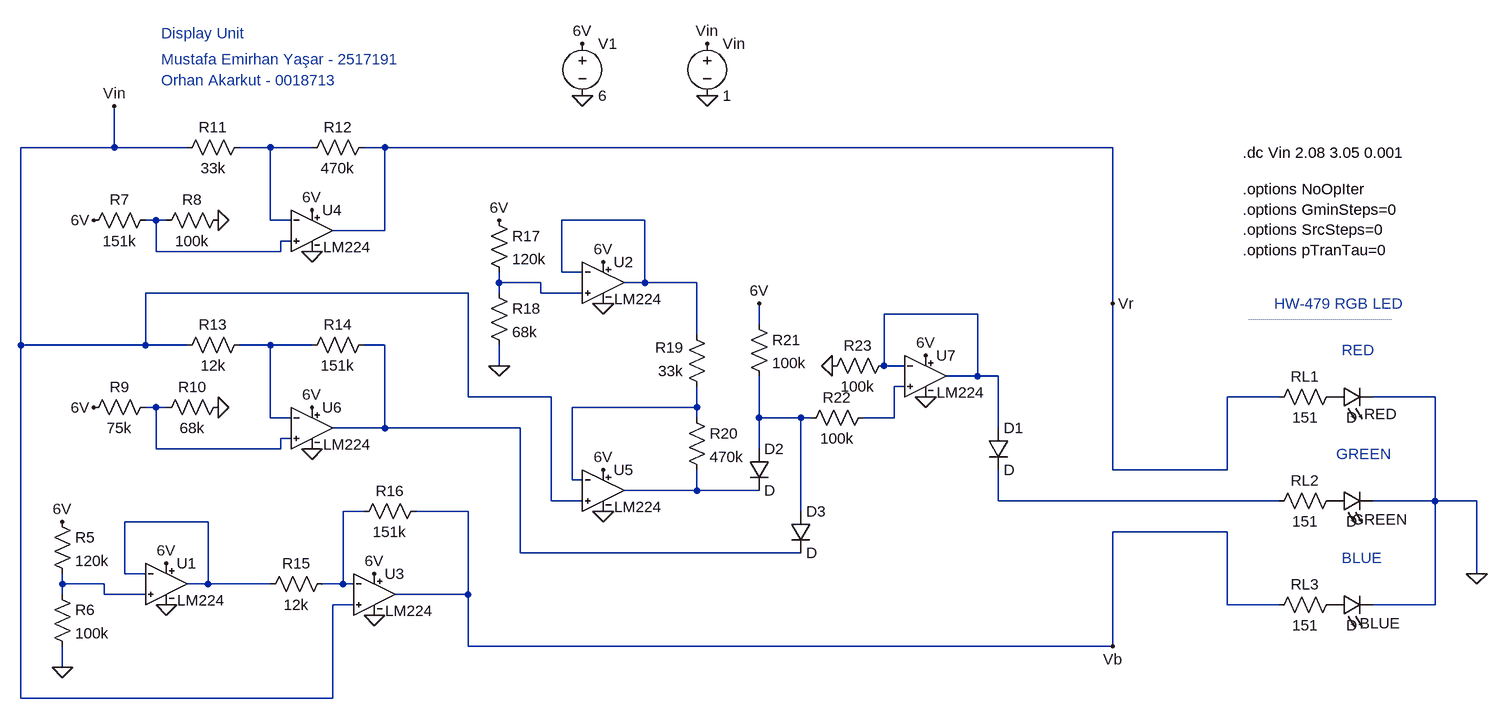
[diagram p0: schematic Unit_Display.asc]
Unit_Display.asc, the LTspice schematic file:
Version 4
SHEET 1 2628 820
WIRE -128 -416 -128 -480
WIRE -128 -416 -272 -416
WIRE -16 -416 -128 -416
WIRE 112 -416 64 -416
WIRE 176 -416 112 -416
WIRE 288 -416 256 -416
WIRE 1408 -416 288 -416
WIRE -64 -304 -80 -304
WIRE -48 -304 -64 -304
WIRE 112 -304 112 -416
WIRE 144 -304 112 -304
WIRE 688 -304 560 -304
WIRE 288 -288 288 -416
WIRE 288 -288 208 -288
WIRE 144 -272 128 -272
WIRE -64 -256 -64 -304
WIRE 128 -256 128 -272
WIRE 128 -256 -64 -256
WIRE 560 -224 560 -304
WIRE 592 -224 560 -224
WIRE 464 -208 464 -224
WIRE 528 -208 464 -208
WIRE 688 -208 688 -304
WIRE 688 -208 656 -208
WIRE 768 -208 688 -208
WIRE 416 -192 -80 -192
WIRE 464 -192 464 -208
WIRE 528 -192 528 -208
WIRE 592 -192 528 -192
WIRE 1408 -176 1408 -416
WIRE 1200 -160 1056 -160
WIRE 864 -144 864 -176
WIRE 768 -128 768 -208
WIRE -272 -112 -272 -416
WIRE -80 -112 -80 -192
WIRE -80 -112 -272 -112
WIRE -16 -112 -80 -112
WIRE 112 -112 64 -112
WIRE 176 -112 112 -112
WIRE 288 -112 256 -112
WIRE 464 -80 464 -112
WIRE 1056 -80 1056 -160
WIRE 1088 -80 1056 -80
WIRE 1200 -64 1200 -160
WIRE 1200 -64 1152 -64
WIRE 1232 -64 1200 -64
WIRE 1088 -48 1072 -48
WIRE 416 -32 416 -192
WIRE 544 -32 416 -32
WIRE 1664 -32 1584 -32
WIRE 1904 -32 1808 -32
WIRE -64 -16 -80 -16
WIRE -48 -16 -64 -16
WIRE 768 -16 768 -48
WIRE 768 -16 576 -16
WIRE 112 0 112 -112
WIRE 144 0 112 0
WIRE 768 0 768 -16
WIRE 864 0 864 -64
WIRE 928 0 864 0
WIRE 944 0 928 0
WIRE 1072 0 1072 -48
WIRE 1072 0 1024 0
WIRE 288 16 288 -112
WIRE 288 16 208 16
WIRE 496 16 288 16
WIRE 1232 16 1232 -64
WIRE 144 32 128 32
WIRE -64 48 -64 -16
WIRE 128 48 128 32
WIRE 128 48 -64 48
WIRE 864 48 864 0
WIRE 1408 80 1408 -176
WIRE 1584 80 1584 -32
WIRE 1584 80 1408 80
WIRE 576 96 576 -16
WIRE 592 96 576 96
WIRE 768 112 768 80
WIRE 768 112 656 112
WIRE 864 112 768 112
WIRE 544 128 544 -32
WIRE 592 128 544 128
WIRE 1232 128 1232 80
WIRE 1664 128 1232 128
WIRE 1904 128 1904 -32
WIRE 1904 128 1808 128
WIRE 1968 128 1904 128
WIRE 256 144 224 144
WIRE 416 144 336 144
WIRE 928 144 928 0
WIRE 16 160 -112 160
WIRE 1584 176 1408 176
WIRE 496 208 496 16
WIRE 928 208 496 208
WIRE -112 240 -112 160
WIRE -80 240 -112 240
WIRE 1968 240 1968 128
WIRE -208 256 -208 240
WIRE -144 256 -208 256
WIRE 16 256 16 160
WIRE 16 256 -16 256
WIRE 112 256 16 256
WIRE 224 256 224 144
WIRE 224 256 192 256
WIRE 240 256 224 256
WIRE -208 272 -208 256
WIRE -144 272 -144 256
WIRE -80 272 -144 272
WIRE 416 272 416 144
WIRE 416 272 304 272
WIRE 240 288 208 288
WIRE 1584 288 1584 176
WIRE 1664 288 1584 288
WIRE 1904 288 1904 128
WIRE 1904 288 1808 288
WIRE 416 352 416 272
WIRE 1408 352 1408 176
WIRE 1408 352 416 352
WIRE -208 384 -208 352
WIRE -272 432 -272 -112
WIRE 208 432 208 288
WIRE 208 432 -272 432
FLAG 592 -496 0
FLAG 592 -576 6V
FLAG -208 160 6V
FLAG 1968 240 0
FLAG 784 -496 0
FLAG 784 -576 Vin
FLAG -128 -480 Vin
FLAG -208 384 0
FLAG 32 -304 0
FLAG -160 -304 6V
FLAG 1408 -176 Vr
FLAG 1408 352 Vb
FLAG 464 -304 6V
FLAG 464 -80 0
FLAG 32 -16 0
FLAG -160 -16 6V
FLAG 976 -80 0
FLAG -48 288 0
FLAG 272 304 0
FLAG 624 144 0
FLAG 1120 -32 0
FLAG 624 -176 0
FLAG 176 48 0
FLAG 176 -256 0
FLAG 176 -320 6V
FLAG 624 -240 6V
FLAG 176 -16 6V
FLAG -48 224 6V
FLAG 272 240 6V
FLAG 624 80 6V
FLAG 1120 -96 6V
FLAG 864 -176 6V
SYMBOL OpAmps\\LM224 -48 192 R0
SYMATTR InstName U1
SYMBOL voltage 592 -592 R0
WINDOW 123 0 0 Left 0
WINDOW 39 0 0 Left 0
SYMATTR InstName V1
SYMATTR Value 6
SYMBOL res -224 144 R0
SYMATTR InstName R5
SYMATTR Value 120k
SYMBOL res -224 256 R0
SYMATTR InstName R6
SYMATTR Value 100k
SYMBOL OpAmps\\LM224 272 208 R0
SYMATTR InstName U3
SYMBOL res 208 240 R90
WINDOW 0 0 56 VBottom 2
WINDOW 3 32 56 VTop 2
SYMATTR InstName R15
SYMATTR Value 12k
SYMBOL res 352 128 R90
WINDOW 0 0 56 VBottom 2
WINDOW 3 32 56 VTop 2
SYMATTR InstName R16
SYMATTR Value 151k
SYMBOL OpAmps\\LM224 176 -352 R0
SYMATTR InstName U4
SYMBOL res 80 -432 R90
WINDOW 0 0 56 VBottom 2
WINDOW 3 32 56 VTop 2
SYMATTR InstName R11
SYMATTR Value 33k
SYMBOL res 272 -432 R90
WINDOW 0 0 56 VBottom 2
WINDOW 3 32 56 VTop 2
SYMATTR InstName R12
SYMATTR Value 470k
SYMBOL LED 1744 -16 R270
WINDOW 0 -26 76 VTop 2
WINDOW 3 0 32 VBottom 2
SYMATTR InstName RED
SYMBOL LED 1744 144 R270
WINDOW 0 -28 75 VTop 2
WINDOW 3 0 32 VBottom 2
SYMATTR InstName GREEN
SYMBOL LED 1744 304 R270
WINDOW 0 -28 75 VTop 2
WINDOW 3 0 32 VBottom 2
SYMATTR InstName BLUE
SYMBOL res 1760 -48 R90
WINDOW 0 0 56 VBottom 2
WINDOW 3 32 56 VTop 2
SYMATTR InstName RL1
SYMATTR Value 151
SYMBOL res 1760 112 R90
WINDOW 0 0 56 VBottom 2
WINDOW 3 32 56 VTop 2
SYMATTR InstName RL2
SYMATTR Value 151
SYMBOL res 1760 272 R90
WINDOW 0 0 56 VBottom 2
WINDOW 3 32 56 VTop 2
SYMATTR InstName RL3
SYMATTR Value 151
SYMBOL voltage 784 -592 R0
WINDOW 123 0 0 Left 0
WINDOW 39 0 0 Left 0
SYMATTR InstName Vin
SYMATTR Value 1
SYMBOL res -64 -320 R90
WINDOW 0 0 56 VBottom 2
WINDOW 3 32 56 VTop 2
SYMATTR InstName R7
SYMATTR Value 151k
SYMBOL res 48 -320 R90
WINDOW 0 0 56 VBottom 2
WINDOW 3 32 56 VTop 2
SYMATTR InstName R8
SYMATTR Value 100k
SYMBOL OpAmps\\LM224 624 -272 R0
SYMATTR InstName U2
SYMBOL res 448 -320 R0
SYMATTR InstName R17
SYMATTR Value 120k
SYMBOL res 448 -208 R0
SYMATTR InstName R18
SYMATTR Value 68k
SYMBOL OpAmps\\LM224 624 48 R0
SYMATTR InstName U5
SYMBOL res 784 -32 R180
WINDOW 0 36 76 Left 2
WINDOW 3 36 40 Left 2
SYMATTR InstName R19
SYMATTR Value 33k
SYMBOL res 752 -16 R0
SYMATTR InstName R20
SYMATTR Value 470k
SYMBOL OpAmps\\LM224 176 -48 R0
SYMATTR InstName U6
SYMBOL res 80 -128 R90
WINDOW 0 0 56 VBottom 2
WINDOW 3 32 56 VTop 2
SYMATTR InstName R13
SYMATTR Value 12k
SYMBOL res 272 -128 R90
WINDOW 0 0 56 VBottom 2
WINDOW 3 32 56 VTop 2
SYMATTR InstName R14
SYMATTR Value 151k
SYMBOL res -64 -32 R90
WINDOW 0 0 56 VBottom 2
WINDOW 3 32 56 VTop 2
SYMATTR InstName R9
SYMATTR Value 75k
SYMBOL res 48 -32 R90
WINDOW 0 0 56 VBottom 2
WINDOW 3 32 56 VTop 2
SYMATTR InstName R10
SYMATTR Value 68k
SYMBOL OpAmps\\LM224 1120 -128 R0
SYMATTR InstName U7
SYMBOL res 1072 -96 R90
WINDOW 0 0 56 VBottom 2
WINDOW 3 32 56 VTop 2
SYMATTR InstName R23
SYMATTR Value 100k
SYMBOL diode 1216 16 R0
SYMATTR InstName D1
SYMBOL diode 848 48 R0
SYMATTR InstName D2
SYMBOL diode 912 144 R0
SYMATTR InstName D3
SYMBOL res 848 -160 R0
SYMATTR InstName R21
SYMATTR Value 100k
SYMBOL res 1040 -16 R90
WINDOW 0 0 56 VBottom 2
WINDOW 3 32 56 VTop 2
SYMATTR InstName R22
SYMATTR Value 100k
TEXT -56 -592 Left 2 ;Display Unit
TEXT -56 -552 Left 2 ;Mustafa Emirhan Yaşar - 2517191
TEXT -56 -520 Left 2 ;Orhan Akarkut - 0018713
TEXT 1760 -104 Left 2 ;RED
TEXT 1752 56 Left 2 ;GREEN
TEXT 1760 216 Left 2 ;BLUE
TEXT 1656 -176 Left 2 ;HW-479 RGB LED
TEXT 1616 -152 Left 0 ;------------------------------------------------------------------------
TEXT 1608 -408 Left 2 !.dc Vin 2.08 3.05 0.001
TEXT 1608 -352 Left 2 !.options NoOpIter\n.options GminSteps=0\n.options SrcSteps=0\n.options pTranTau=0

The netlist it stands for:
* Unit_Display.asc
XU1 N016 N015 6V 0 N015 LM224  ; pins In+ In- V+ V- OUT
V1 6V 0 6
R5 6V N016 120k
R6 N016 0 100k
XU3 Vin N014 6V 0 Vb LM224  ; pins In+ In- V+ V- OUT
R15 N014 N015 12k
R16 Vb N014 151k
XU4 N002 N001 6V 0 Vr LM224  ; pins In+ In- V+ V- OUT
R11 N001 Vin 33k
R12 Vr N001 470k
D§RED P001 0 D
D§GREEN P002 0 D
D§BLUE P003 0 D
RL1 P001 Vr 151
RL2 P002 N013 151
RL3 P003 Vb 151
Vin Vin 0 1
R7 N002 6V 151k
R8 0 N002 100k
XU2 N004 N003 6V 0 N003 LM224  ; pins In+ In- V+ V- OUT
R17 6V N004 120k
R18 N004 0 68k
XU5 Vin N010 6V 0 N012 LM224  ; pins In+ In- V+ V- OUT
R19 N010 N003 33k
R20 N010 N012 470k
XU6 N009 N006 6V 0 N007 LM224  ; pins In+ In- V+ V- OUT
R13 N006 Vin 12k
R14 N007 N006 151k
R9 N009 6V 75k
R10 0 N009 68k
XU7 N008 N005 6V 0 N005 LM224  ; pins In+ In- V+ V- OUT
R23 N005 0 100k
D1 N005 N013 D
D2 N011 N012 D
D3 N011 N007 D
R21 6V N011 100k
R22 N008 N011 100k
.model D D
.lib standard.dio
* Display Unit
* Mustafa Emirhan Yaşar - 2517191
* Orhan Akarkut - 0018713
* RED
* GREEN
* BLUE
* HW-479 RGB LED
* ------------------------------------------------------------------------
.dc Vin 2.08 3.05 0.001
.options NoOpIter
.options GminSteps=0
.options SrcSteps=0
.options pTranTau=0
.lib LM224.lib
.backanno
.end